# Altium schematic sheet DM1097_JTAG.SchDoc: =project_title
size Tabloid; CompanyName: Luxonis Holding; Organization: Luxonis Holding; Address1: 1925 Harmony Park Drive; Address2: Westminster, CO; Address3: 80234; Address4: United States; SheetNumber: 15; SheetTotal: 17
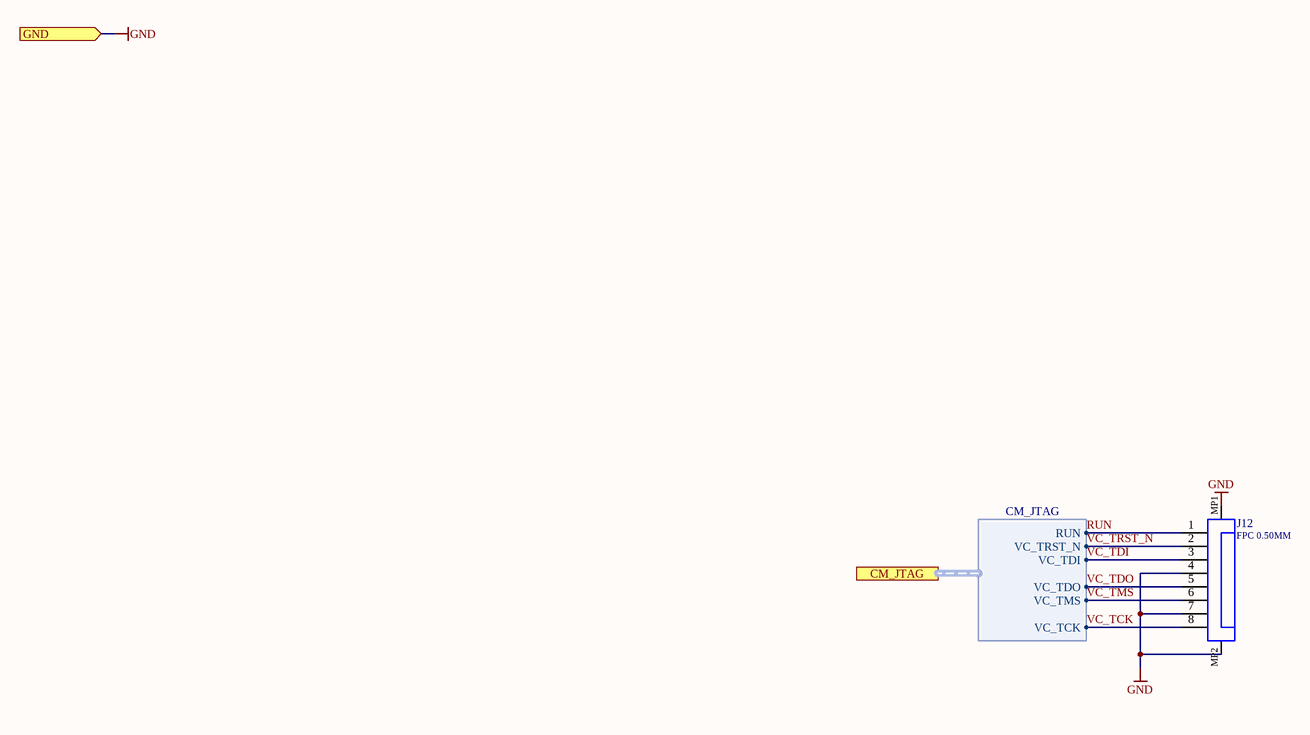
[diagram p0: DM1097_JTAG.SchDoc]

## Parts
J12  FPC 0.50MM  [68710814522]

## Ports
CM_JTAG (harness CM_JTAG), GND (in)

## Harnesses
CM_JTAG: RUN, VC_TRST_N, VC_TDI, VC_TDO, VC_TMS, VC_TCK

## Nets
GND: J12.4 J12.7 J12.MP1 J12.MP2 ; port GND
RUN: J12.1 ; port CM_JTAG.RUN
VC_TCK: J12.8 ; port CM_JTAG.VC_TCK
VC_TDI: J12.3 ; port CM_JTAG.VC_TDI
VC_TDO: J12.5 ; port CM_JTAG.VC_TDO
VC_TMS: J12.6 ; port CM_JTAG.VC_TMS
VC_TRST_N: J12.2 ; port CM_JTAG.VC_TRST_N

## Notes on the sheet
- Title
- Size:
- Date:
- Tabloid
- Number:
- Time:
- Revision:
- Sheet
- of
- Drawn by:

## Library data of the parts
J12 = 68710814522: CONN FPC BOTTOM 8POS 0.50MM R/A 8 Position FPC Connector Contacts, Bottom 0.020" (0.50mm) Surface Mount, Right Angle; Manufacturer 1: Wurth Electronics; Actuator Material: Polymer,Liquid Crystal Polymer; Current Rating: 500mA; Voltage Rating: 50V; Number of Positions: 8; Insulation Resistance: 100MR; Gender: Male; Pitch: 0.5mm; Manufacturer Part Number 1: 68710814522; Supplier 1: Digi-Key; Stock 1: 1995; Pricing 1: 1=1.03000, 10=0.99100, 50=0.92300, 100=0.85400, 500=0.78600, 1000=0.71800 (USD); RoHS: Yes; Mount: Surface Mount; Contact Material: Bronze,Tin; Contact Plating: Tin; Housing Material: Liquid Crystal Polymer; Min Operating Temperature: -25°C; Max Operating Temperature: 85°C; Number of Rows: 1; Packaging: Tape and Reel; Package Quantity: 2000; Contact Location: Bottom; Termination: SMD/SMT; Number of Contacts: 8; Orientation: Straight; Length: 10.4mm; Width: 2.1mm; REACH SVHC: Unknown; Flammability Rating: UL94 V-0; ComponentLink1URL: https://datasheet.ciiva.com/670/6871xx14522-670726.pdf?src-supplier=Digi-Key; ComponentLink1Description: https://datasheet.ciiva.com/670/6871xx14522-670726.pdf?src-supplier=Digi-Key; ComponentLink2URL: https://datasheet.ciiva.com/670/6871xx14522-670727.pdf?src-supplier=Digi-Key; ComponentLink2Description: https://datasheet.ciiva.com/670/6871xx14522-670727.pdf?src-supplier=Digi-Key; ComponentLink3URL: https://datasheet.ciiva.com/670/6871xx14522-670728.pdf?src-supplier=Digi-Key; ComponentLink3Description: https://datasheet.ciiva.com/670/6871xx14522-670728.pdf?src-supplier=Digi-Key; ComponentLink4URL: https://datasheet.ciiva.com/14153/6871xx14522-eng-datasheet-14153886.pdf?src-supplier=Distrelec; ComponentLink4Description: https://datasheet.ciiva.com/14153/6871xx14522-eng-datasheet-14153886.pdf?src-supplier=Distrelec; ComponentLink5URL: https://datasheet.ciiva.com/29318/709082-da-01-en-smd-zif-stecker-90grad-kontakte-unten-8-29318044.pdf?src-supplier=Conrad; ComponentLink5Description: https://datasheet.ciiva.com/29318/709082-da-01-en-smd-zif-stecker-90grad-kontakte-unten-8-29318044.pdf?src-supplier=Conrad; Supplier Part Number 1: 732-2011-1-ND